# Altium project PBL4_2026L_runIT.PrjPcb (part 2 of 2)

## Sheet MCU.SchDoc: ESP32-S3
size 292 x 193 mm; CheckedBy: Jakub Howors; Author: Łukasz Gójski; CompanyName: Politechnika Warszawska; Organization: EITI; Address1: Nowowiejska 15/19; Address2: 00-665 Warszawa; Revision: 1.0; SheetNumber: 8; SheetTotal: 13; HTTPLink: www.pw.edu.pl; Group_Name: grupa 3; ProjName: runIT
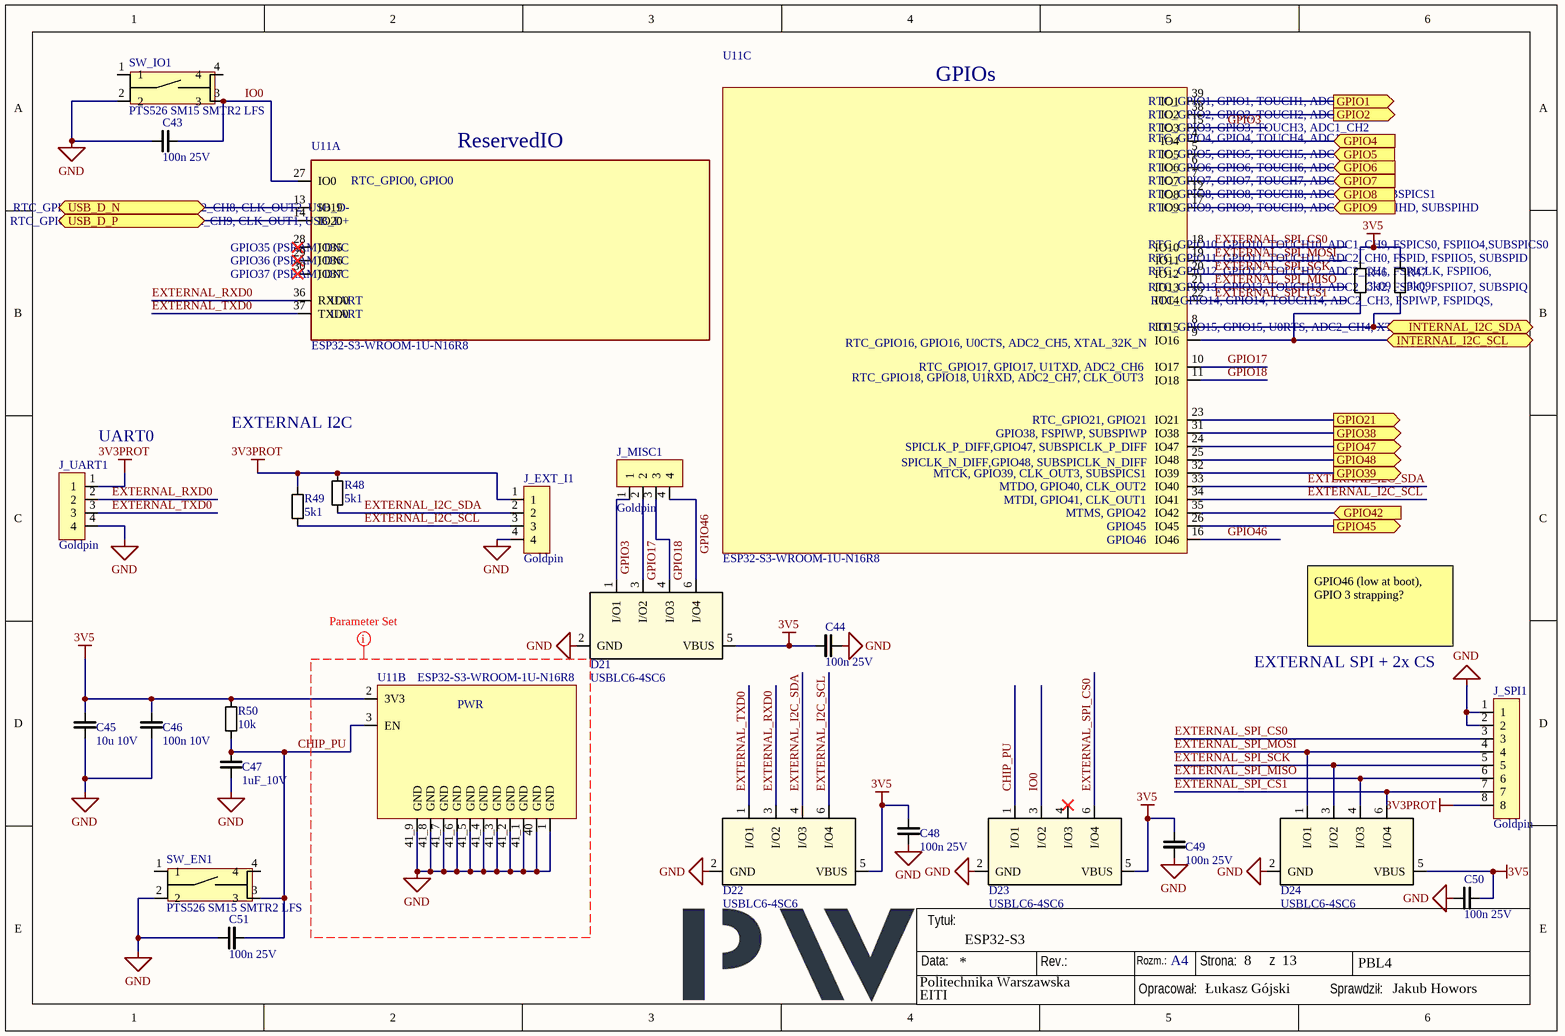
[diagram p10: MCU.SchDoc]

### Parts
C43  100n 25V  [C_0603]
C44  100n 25V  [C_0603]
C45  10u 10V  [C_0805]
C46  100n 10V  [C_0603]
C47  1uF_10V  [C_0603]
C48  100n 25V  [C_0603]
C49  100n 25V  [C_0603]
C50  100n 25V  [C_0603]
C51  100n 25V  [C_0603]
D21  USBLC6-4SC6  [SOT23-6L_STM]
D22  USBLC6-4SC6  [SOT23-6L_STM]
D23  USBLC6-4SC6  [SOT23-6L_STM]
D24  USBLC6-4SC6  [SOT23-6L_STM]
J_EXT_I1  Goldpin  [goldpin4]
J_MISC1  Goldpin  [goldpin4]
J_SPI1  Goldpin  [goldpin8]
J_UART1  Goldpin  [goldpin4]
R46  3k09  [R_0603]
R47  3k09  [R_0603]
R48  5k1  [R_0603]
R49  5k1  [R_0603]
R50  10k  [R_0603]
SW_EN1  PTS526 SM15 SMTR2 LFS  [PTS526SK15SMTR2LFS]
SW_IO1  PTS526 SM15 SMTR2 LFS  [PTS526SK15SMTR2LFS]
U11  ESP32-S3-WROOM-1U-N16R8  [XCVR_ESP32-S3-WROOM-1U-N16R8]  (parts A,B,C of 3)

### Ports
GPIO1 (out, see MainAssembly[2D]), GPIO2 (out, see MainAssembly[2D]), GPIO4 (in, see MainAssembly[1D]), GPIO5 (in, see MainAssembly[1D]), GPIO6 (in, see MainAssembly[1E]), GPIO7 (in, see MainAssembly[1E]), GPIO8 (in, see MainAssembly[1D]), GPIO9 (in, see MainAssembly[1D]), GPIO21 (out, see MainAssembly[2D]), GPIO38 (out, see MainAssembly[2E]), GPIO39 (out, see MainAssembly[2E]), GPIO42 (in, see MainAssembly[1D]), GPIO45 (out, see MainAssembly[2D]), GPIO47 (out, see MainAssembly[2D]), GPIO48 (out, see MainAssembly[2D]), INTERNAL_I2C_SCL (bidir, see MainAssembly[2C], PowerAssembly[4D]), INTERNAL_I2C_SDA (bidir, see MainAssembly[2C], PowerAssembly[4C]), USB_D_N (bidir, see MainAssembly[1C], PowerAssembly[1A], USBPD[1D]), USB_D_P (bidir, see MainAssembly[1C], PowerAssembly[1A], USBPD[1D])

### Nets
3V3PROT: J_EXT_I1.1 J_SPI1.8 J_UART1.1 R48.2 R49.2
3V5: C44.2 C45.2 C46.2 C48.2 C49.2 C50.2 D21.5(VBUS) D22.5(VBUS) D23.5(VBUS) D24.5(VBUS) R46.2 R47.2 R50.2 U11.2(3V3)
GND: C43.1 C44.1 C45.1 C46.1 C47.1 C48.1 C49.1 C50.1 C51.1 D21.2(GND) D22.2(GND) D23.2(GND) D24.2(GND) J_EXT_I1.4 J_SPI1.1 J_SPI1.2 J_UART1.4 SW_EN1.2 SW_IO1.2 U11.1(GND) U11.40(GND) U11.41_1(GND) U11.41_2(GND) U11.41_3(GND) U11.41_4(GND) U11.41_5(GND) U11.41_6(GND) U11.41_7(GND) U11.41_8(GND) U11.41_9(GND)
ADS_ALERT: U11.35(IO42) ; port GPIO42
CHIP_PU: C47.2 C51.2 D23.1(I/O1) R50.1 SW_EN1.3 U11.3(EN)
DRV_1_EN1: U11.31(IO38) ; port GPIO38
DRV_1_EN2: U11.32(IO39) ; port GPIO39
DRV_1_EN3: U11.38(IO2) ; port GPIO2
DRV_1_EN4: U11.39(IO1) ; port GPIO1
DRV_1_IN1: U11.23(IO21) ; port GPIO21
DRV_1_IN2: U11.24(IO47) ; port GPIO47
DRV_1_IN3: U11.25(IO48) ; port GPIO48
DRV_1_IN4: U11.26(IO45) ; port GPIO45
DRV_1_IPROPI_1: U11.7(IO7) ; port GPIO7
DRV_1_IPROPI_2: U11.6(IO6) ; port GPIO6
DRV_1_IPROPI_3: U11.5(IO5) ; port GPIO5
DRV_1_IPROPI_4: U11.4(IO4) ; port GPIO4
EXTERNAL_I2C_SCL: D22.6(I/O4) J_EXT_I1.3 R49.1 U11.34(IO41)
EXTERNAL_I2C_SDA: D22.4(I/O3) J_EXT_I1.2 R48.1 U11.33(IO40)
EXTERNAL_RXD0: D22.3(I/O2) J_UART1.2 U11.36(RXD0)
EXTERNAL_SPI_CS0: D23.6(I/O4) J_SPI1.3 U11.18(IO10)
EXTERNAL_SPI_CS1: D24.6(I/O4) J_SPI1.7 U11.22(IO14)
EXTERNAL_SPI_MISO: D24.4(I/O3) J_SPI1.6 U11.21(IO13)
EXTERNAL_SPI_MOSI: D24.1(I/O1) J_SPI1.4 U11.19(IO11)
EXTERNAL_SPI_SCK: D24.3(I/O2) J_SPI1.5 U11.20(IO12)
EXTERNAL_TXD0: D22.1(I/O1) J_UART1.3 U11.37(TXD0)
GPIO3: D21.1(I/O1) J_MISC1.1 U11.15(IO3)
GPIO17: D21.3(I/O2) J_MISC1.2 U11.10(IO17)
GPIO18: D21.4(I/O3) J_MISC1.3 U11.11(IO18)
GPIO46: D21.6(I/O4) J_MISC1.4 U11.16(IO46)
INTERNAL_I2C_SCL: R46.1 U11.9(IO16) ; port INTERNAL_I2C_SCL
INTERNAL_I2C_SDA: R47.1 U11.8(IO15) ; port INTERNAL_I2C_SDA
IO0: C43.2 D23.3(I/O2) SW_IO1.3 U11.27(IO0)
TCA6424_nINT: U11.17(IO9) ; port GPIO9
TCA6424_nRESET: U11.12(IO8) ; port GPIO8
USB_D_N: U11.13(IO19) ; port USB_D_N
USB_D_P: U11.14(IO20) ; port USB_D_P

Not connected (* = marked no-connect by the designer): D23 4(I/O3)*; SW_EN1 1 4; SW_IO1 1 4; U11 28(IO35)* 29(IO36)* 30(IO37)*

### Layout directives
CompClassName: NoRelief: GND

### Notes on the sheet
- (near J_UART1) UART0
- EXTERNAL I2C
- GPIO46 (low at boot), GPIO 3 strapping?
- EXTERNAL SPI + 2x CS
- Data:
- Tytuł:
- Rev.:
- Rozm.:
- A4
- Strona:
- z
- PBL4
- Opracował:
- Sprawdził:
- (in symbol ESP32-S3-WROOM-1U-N16R8, part A) ReservedIO; RTC_GPIO0, GPIO0; RTC_GPIO19, GPIO19, U1RTS, ADC2_CH8, CLK_OUT2, USB_D-; RTC_GPIO20, GPIO20, U1CTS, ADC2_CH9, CLK_OUT1, USB_D+; GPIO35 (PSRAM) DNC; GPIO36 (PSRAM) DNC; GPIO37 (PSRAM) DNC; UART
- (in symbol ESP32-S3-WROOM-1U-N16R8, part B) PWR
- (in symbol ESP32-S3-WROOM-1U-N16R8, part C) GPIOs; RTC_GPIO1, GPIO1, TOUCH1, ADC1_CH0; RTC_GPIO2, GPIO2, TOUCH2, ADC1_CH1; RTC_GPIO3, GPIO3, TOUCH3, ADC1_CH2; RTC_GPIO4, GPIO4, TOUCH4, ADC1_CH3; RTC_GPIO5, GPIO5, TOUCH5, ADC1_CH4; RTC_GPIO6, GPIO6, TOUCH6, ADC1_CH5; RTC_GPIO7, GPIO7, TOUCH7, ADC1_CH6; RTC_GPIO8, GPIO8, TOUCH8, ADC1_CH7, SUBSPICS1; RTC_GPIO9, GPIO9, TOUCH9, ADC1_CH8, FSPIHD, SUBSPIHD; RTC_GPIO10, GPIO10, TOUCH10, ADC1_CH9, FSPICS0, FSPIIO4,SUBSPICS0; RTC_GPIO11, GPIO11, TOUCH11, ADC2_CH0, FSPID, FSPIIO5, SUBSPID; RTC_GPIO12, GPIO12, TOUCH12, ADC2_CH1, FSPICLK, FSPIIO6,; RTC_GPIO13, GPIO13, TOUCH13, ADC2_CH2, FSPIQ, FSPIIO7, SUBSPIQ; RTC_GPIO14, GPIO14, TOUCH14, ADC2_CH3, FSPIWP, FSPIDQS,; RTC_GPIO15, GPIO15, U0RTS, ADC2_CH4, XTAL_32K_P; RTC_GPIO16, GPIO16, U0CTS, ADC2_CH5, XTAL_32K_N; RTC_GPIO17, GPIO17, U1TXD, ADC2_CH6; RTC_GPIO18, GPIO18, U1RXD, ADC2_CH7, CLK_OUT3; RTC_GPIO21, GPIO21; GPIO38, FSPIWP, SUBSPIWP; SPICLK_P_DIFF,GPIO47, SUBSPICLK_P_DIFF; SPICLK_N_DIFF,GPIO48, SUBSPICLK_N_DIFF; MTCK, GPIO39, CLK_OUT3, SUBSPICS1; MTDO, GPIO40, CLK_OUT2; MTDI, GPIO41, CLK_OUT1; MTMS, GPIO42; GPIO45; GPIO46

### Library data of the parts
C43 C44 C48-C51 = C_100nF_25V: Ceramic capacitor; Casing: 0603; Dielectric: X7R; Tolerance: 10%; Value: 100n; Voltage: 25V; Technology: Ceramic
C45 = C_10uF_10V: Ceramic capacitor; Casing: 0805; Dielectric: X5R; Tolerance: 10%; Value: 10u; Voltage: 10V; Technology: Ceramic
C46 = C_100nF_10V: as C19 on sheet DCDC3; Value: 100n; Voltage: 10V; Technology: Ceramic
C47 = C_1uF_10V: as C31 on sheet PowerAssembly; Technology: Ceramic
D21-D24 = USBLC6-4SC6: Very low capacitance ESD protection; Manufacturer: STMicroelectronics; Manufacturer_Part_Number: USBLC6-4SC6
J_EXT_I1 J_MISC1 J_UART1 = Goldpin_array_4: Goldpin Male 4
J_SPI1 = Goldpin_array_8: Goldpin Male 8
R46 R47 = R_3k09: Resistor; Tolerance: 1%; Power: 100mW; Casing: 0603; Value: 3k09
R48 R49 = R_5k1: Resistor; Tolerance: 1%; Power: 100mW; Casing: 0603; Value: 5k1
R50 = R_10k: as R75 on sheet PowerAssembly; Value: 10k
SW_EN1 SW_IO1 = Button: NO button; Manufacturer: C&K Components; Manufacturer_Part_Number: PTS526 SM15 SMTR2 LFS
U11 = ESP32-S3-WROOM-1U-N16R8: Bluetooth, WiFi 802.11b/g/n, Bluetooth v5.0 Transceiver Module 2.4GHz Antenna Not Included, U.FL Surface Mount; MF: Espressif Systems; Package: None; Price: None; Value: *; SnapEDA_Link: https://www.snapeda.com/parts/ESP32-S3-WROOM-1U-N16R8/Espressif+Systems/view-part/?ref=snap; MP: ESP32-S3-WROOM-1U-N16R8; Availability: Unavailable; Check_prices: https://www.snapeda.com/parts/ESP32-S3-WROOM-1U-N16R8/Espressif+Systems/view-part/?ref=eda

## Sheet ADCHighVoltageInputsSchDoc.SchDoc: High Voltage Inputs
size 292 x 193 mm; CheckedBy: Łukasz Gójski; Author: Jakub Howors; CompanyName: Politechnika Warszawska; Organization: EITI; Address1: Nowowiejska 15/19; Address2: 00-665 Warszawa; Revision: 1.0; SheetNumber: 9; SheetTotal: 13; HTTPLink: www.pw.edu.pl; Group_Name: grupa 3; ProjName: runIT
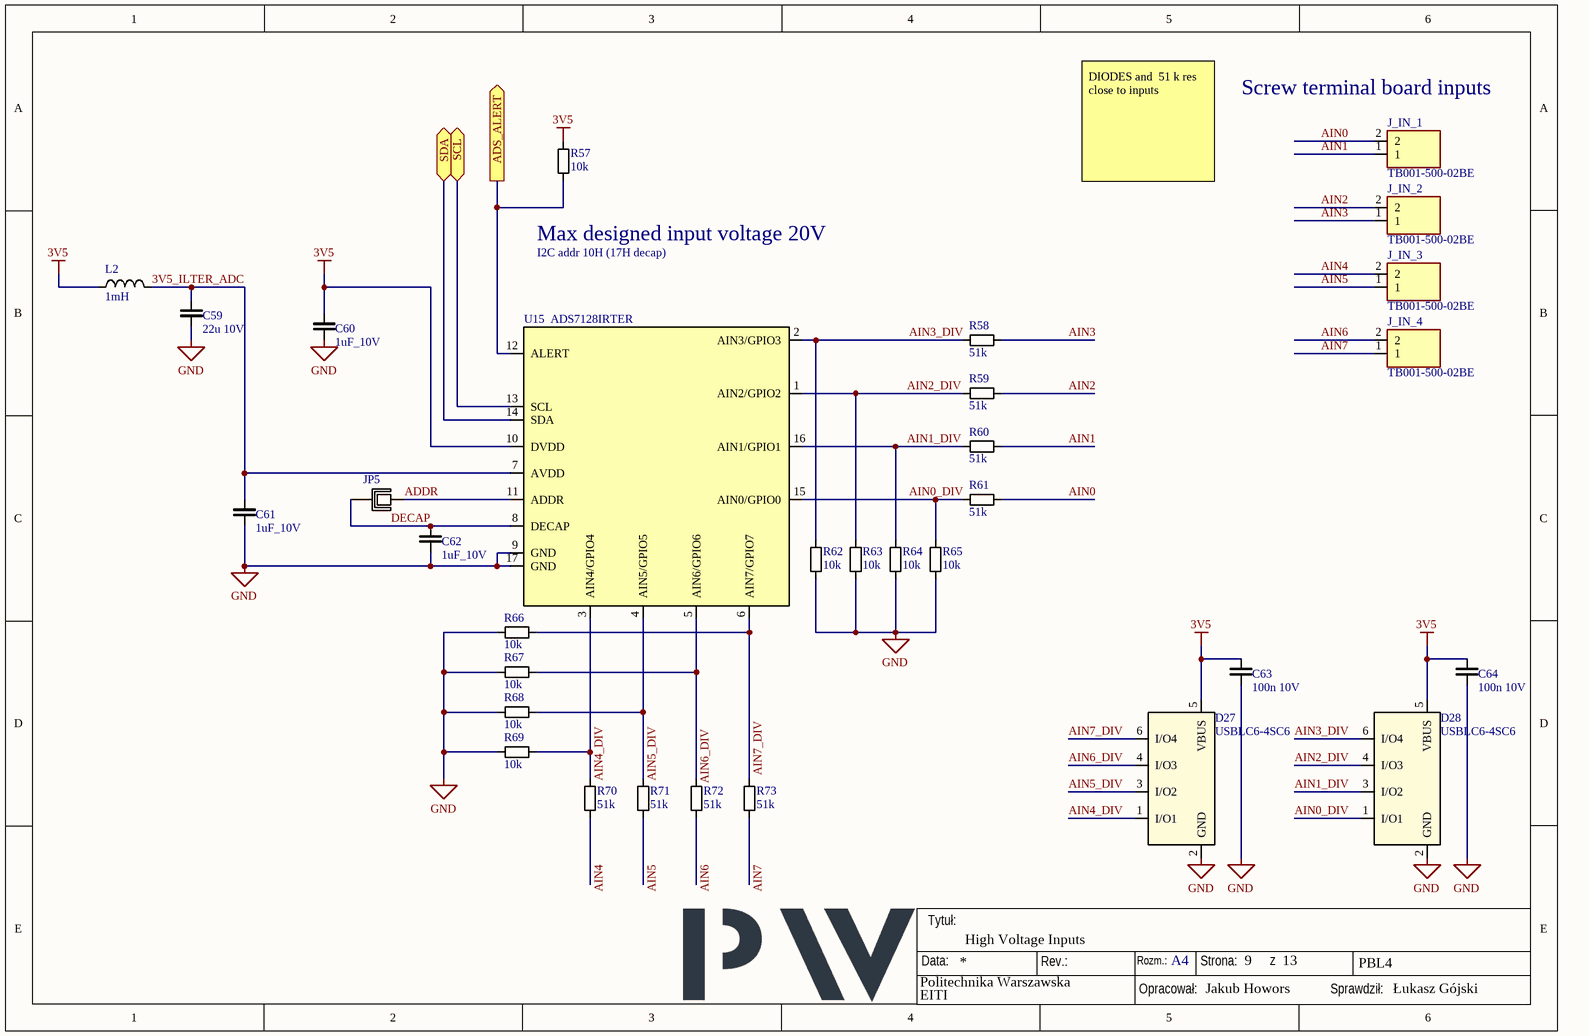
[diagram p11: ADCHighVoltageInputsSchDoc.SchDoc]

### Parts
C59  22u 10V  [C_1206]
C60  1uF_10V  [C_0603]
C61  1uF_10V  [C_0603]
C62  1uF_10V  [C_0603]
C63  100n 10V  [C_0603]
C64  100n 10V  [C_0603]
D27  USBLC6-4SC6  [SOT23-6L_STM]
D28  USBLC6-4SC6  [SOT23-6L_STM]
J_IN_1  TB001-500-02BE  [TB00150002BE]
J_IN_2  TB001-500-02BE  [TB00150002BE]
J_IN_3  TB001-500-02BE  [TB00150002BE]
J_IN_4  TB001-500-02BE  [TB00150002BE]
JP5  JUMPER  [Jumper]  (value not drawn)
L2  1mH  [L_1007]
R57  10k  [R_0603]
R58  51k  [R_0603]
R59  51k  [R_0603]
R60  51k  [R_0603]
R61  51k  [R_0603]
R62  10k  [R_0603]
R63  10k  [R_0603]
R64  10k  [R_0603]
R65  10k  [R_0603]
R66  10k  [R_0603]
R67  10k  [R_0603]
R68  10k  [R_0603]
R69  10k  [R_0603]
R70  51k  [R_0603]
R71  51k  [R_0603]
R72  51k  [R_0603]
R73  51k  [R_0603]
U15  ADS7128IRTER  [ADS7128_RTE0016C]

### Ports
ADS_ALERT (out, see MainAssembly[2B]), SCL (bidir, see MainAssembly[1B], DAC[3C], DCDCreg[2C], GPIOExpander[2B], PWMExpander[2B], USBPD[4C]), SDA (bidir, see MainAssembly[1B], DAC[3C], DCDCreg[2C], GPIOExpander[2B], PWMExpander[2A], USBPD[4C])

### Nets
3V5: C60.2 C63.2 C64.2 D27.5(VBUS) D28.5(VBUS) L2.1 R57.2 U15.10(DVDD)
GND: C59.1 C60.1 C61.1 C62.1 C63.1 C64.1 D27.2(GND) D28.2(GND) R62.2 R63.2 R64.2 R65.2 R66.2 R67.2 R68.2 R69.2 U15.9(GND) U15.17(GND)
3V5_ILTER_ADC: C59.2 C61.2 L2.2 U15.7(AVDD)
ADDR: JP5.1 U15.11(ADDR)
ADS_ALERT: R57.1 U15.12(ALERT) ; port ADS_ALERT
AIN0: J_IN_1.2 R61.2
AIN0_DIV: D28.1(I/O1) R61.1 R65.1 U15.15(AIN0/GPIO0)
AIN1: J_IN_1.1 R60.2
AIN1_DIV: D28.3(I/O2) R60.1 R64.1 U15.16(AIN1/GPIO1)
AIN2: J_IN_2.2 R59.2
AIN2_DIV: D28.4(I/O3) R59.1 R63.1 U15.1(AIN2/GPIO2)
AIN3: J_IN_2.1 R58.2
AIN3_DIV: D28.6(I/O4) R58.1 R62.1 U15.2(AIN3/GPIO3)
AIN4: J_IN_3.2 R70.2
AIN4_DIV: D27.1(I/O1) R69.1 R70.1 U15.3(AIN4/GPIO4)
AIN5: J_IN_3.1 R71.2
AIN5_DIV: D27.3(I/O2) R68.1 R71.1 U15.4(AIN5/GPIO5)
AIN6: J_IN_4.2 R72.2
AIN6_DIV: D27.4(I/O3) R67.1 R72.1 U15.5(AIN6/GPIO6)
AIN7: J_IN_4.1 R73.2
AIN7_DIV: D27.6(I/O4) R66.1 R73.1 U15.6(AIN7/GPIO7)
DECAP: C62.2 JP5.2 U15.8(DECAP)
INTERNAL_I2C_SCL: U15.13(SCL) ; port SCL
INTERNAL_I2C_SDA: U15.14(SDA) ; port SDA

### Notes on the sheet
- (near J_IN_1) Screw terminal board inputs
- DIODES and  51 k res close to inputs
- (near R57) Max designed input voltage 20V
- I2C addr 10H (17H decap)
- Data:
- Tytuł:
- Rev.:
- Rozm.:
- A4
- Strona:
- z
- PBL4
- Opracował:
- Sprawdził:

### Library data of the parts
C59 = C_22uF_10V: Ceramic capacitor; Casing: 1206; Dielectric: X5R; Tolerance: 20%; Value: 22u; Voltage: 10V; Technology: Ceramic
C60-C62 = C_1uF_10V: Ceramic capacitor; Value: 1u; Voltage: 10V; Casing: 0603; Dielectric: X7R; Tolerance: 10%; Technology: Ceramic
C63 C64 = C_100nF_10V: Ceramic capacitor; Casing: 0603; Dielectric: X7R; Tolerance: 10%; Value: 100n; Voltage: 10V; Technology: Ceramic
D27 D28 = USBLC6-4SC6: Very low capacitance ESD protection; Manufacturer: STMicroelectronics; Manufacturer_Part_Number: USBLC6-4SC6
J_IN_1-J_IN_4 = Screw Terminal x2 5mm: Screw terminal x2 5mm spacing; Manufacturer: Same Sky; MP: TB001-500-02BE
JP5 = Jumper x2: Jumper on traces
L2 = L_1mH: Inductor; Casing: 1007; Tolerance: 20%; Idc: 15mA; Value: 1mH
R57 = R_10k: Resistor; Tolerance: 1%; Power: 100mW; Casing: 0603; Value: 10k
R58-R61 R70-R73 = R_51k_LT: Tolerance: 0.1%; Power: 100mW; Casing: 0603; Value: 51k
R62-R69 = R_10k_LT: Tolerance: 0.1%; Power: 125mW; Casing: 0603; Value: 10k
U15 = IC_ads7128_ADS7128IRTER: Small 8-ch 12-bit analog-to-digital converter (ADC) with I2C interface, GPIOs, CRC and RMS module 16-WQFN -40 to 85; Manufacturer_Name: Texas Instruments; Type: Data Acquisition; Copyright: Copyright (C) 2026 Ultra Librarian. All rights reserved.; Manufacturer_Part_Number: ADS7128IRTER; Datasheet: https://www.ti.com/lit/gpn/ads7128; RefDes: RefDes

## Sheet GPIOExpander.SchDoc: Internal GPIO Expander
size 292 x 193 mm; CheckedBy: Łukasz Gójski; Author: Jakub Howors; CompanyName: Politechnika Warszawska; Organization: EITI; Address1: Nowowiejska 15/19; Address2: 00-665 Warszawa; Revision: 1.0; SheetNumber: 7; SheetTotal: 13; HTTPLink: www.pw.edu.pl; Group_Name: grupa 3; ProjName: runIT
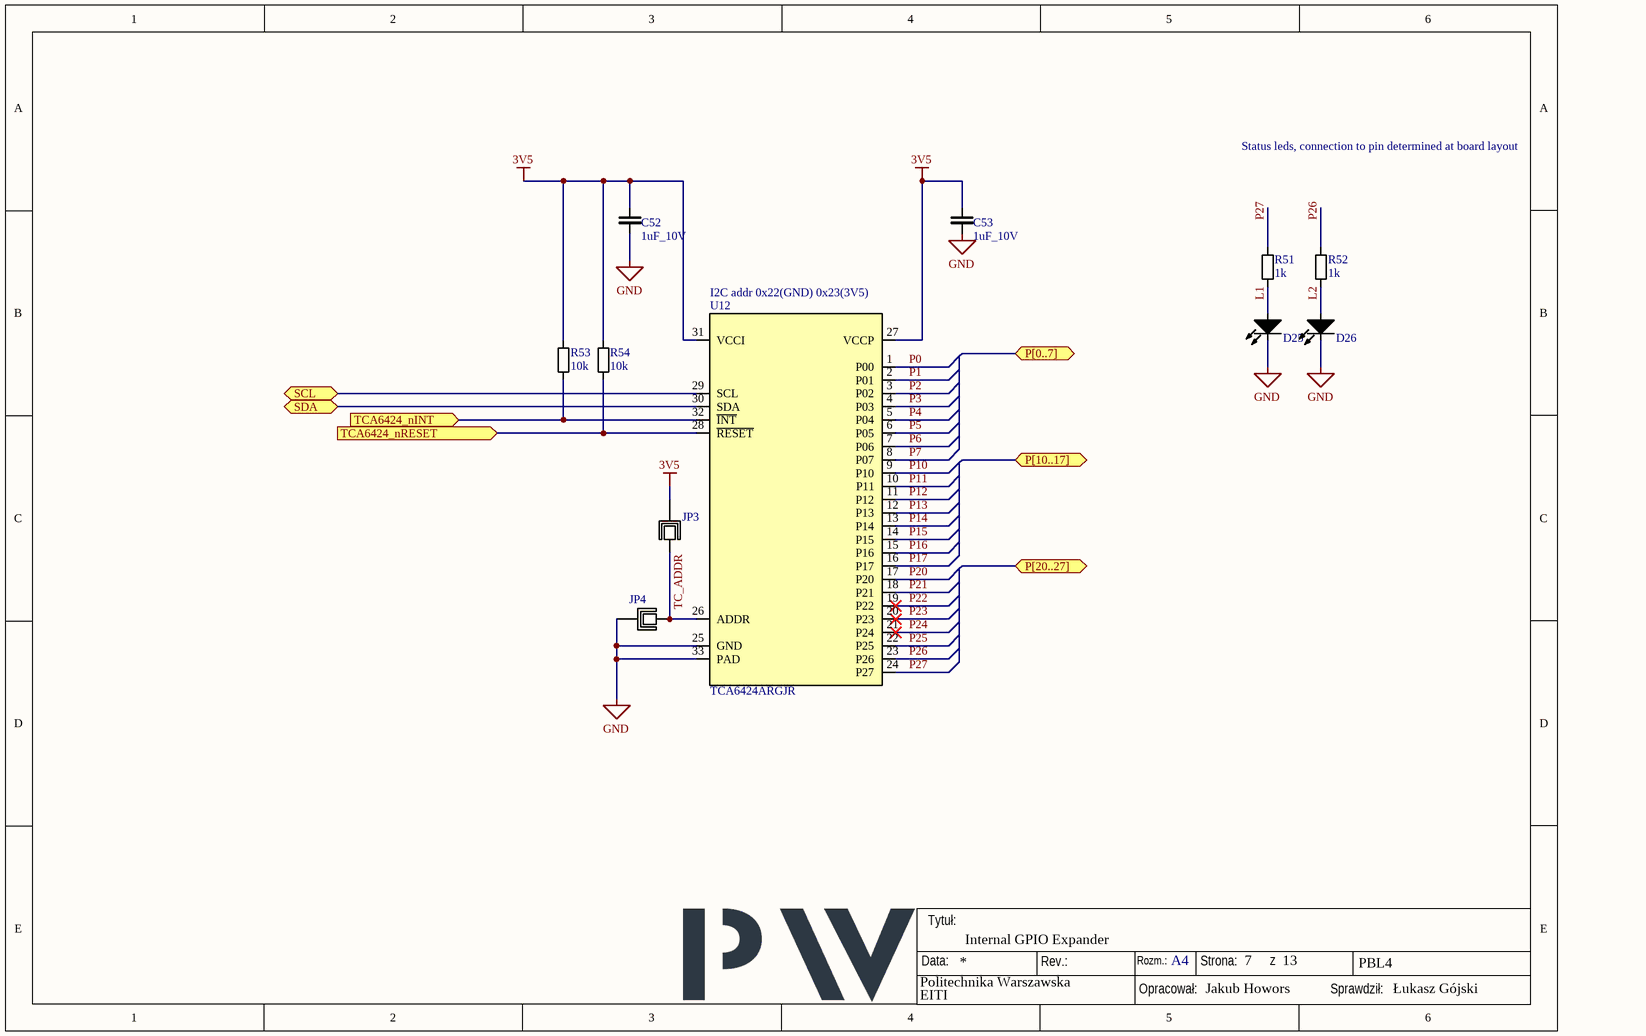
[diagram p12: GPIOExpander.SchDoc]

### Parts
C52  1uF_10V  [C_0603]
C53  1uF_10V  [C_0603]
D25  RED  [LED_0603]  (value not drawn)
D26  RED  [LED_0603]  (value not drawn)
JP3  JUMPER  [Jumper]  (value not drawn)
JP4  JUMPER  [Jumper]  (value not drawn)
R51  1k  [R_0603]
R52  1k  [R_0603]
R53  10k  [R_0603]
R54  10k  [R_0603]
U12  TCA6424ARGJR  [TCA6424A_RGJ0032A]

### Ports
P[0..7] (bidir, see MainAssembly[5D]), P[10..17] (bidir, see MainAssembly[5D]), P[20..27] (bidir, see MainAssembly[6D]), SCL (bidir, see MainAssembly[5D], ADCHighVoltageInputsSchDoc[2A], DAC[3C], DCDCreg[2C], PWMExpander[2B], USBPD[4C]), SDA (bidir, see MainAssembly[5D], ADCHighVoltageInputsSchDoc[2A], DAC[3C], DCDCreg[2C], PWMExpander[2A], USBPD[4C]), TCA6424_nINT (in, see MainAssembly[5D]), TCA6424_nRESET (in, see MainAssembly[5D])

### Nets
3V5: C52.2 C53.2 JP3.2 R53.2 R54.2 U12.27(VCCP) U12.31(VCCI)
GND: C52.1 C53.1 D25.K D26.K JP4.2 U12.25(GND) U12.33(PAD)
INTERNAL_I2C_SCL: U12.29(SCL) ; port SCL
INTERNAL_I2C_SDA: U12.30(SDA) ; port SDA
L1: D25.A R51.1
L2: D26.A R52.1
P0: U12.1(P00)
P1: U12.2(P01)
P2: U12.3(P02)
P3: U12.4(P03)
P4: U12.5(P04)
P5: U12.6(P05)
P6: U12.7(P06)
P7: U12.8(P07)
P10: U12.9(P10)
P11: U12.10(P11)
P12: U12.11(P12)
P13: U12.12(P13)
P14: U12.13(P14)
P15: U12.14(P15)
P16: U12.15(P16)
P17: U12.16(P17)
P20: U12.17(P20)
P21: U12.18(P21)
P22: U12.19(P22)
P23: U12.20(P23)
P24: U12.21(P24)
P25: U12.22(P25)
P26: R52.2 U12.23(P26)
P27: R51.2 U12.24(P27)
TC_ADDR: JP3.1 JP4.1 U12.26(ADDR)
TCA6424_nINT: R53.1 U12.32(~{INT}) ; port TCA6424_nINT
TCA6424_nRESET: R54.1 U12.28(~{RESET}) ; port TCA6424_nRESET

### Notes on the sheet
- Status leds, connection to pin determined at board layout
- (near U12) I2C addr 0x22(GND) 0x23(3V5)
- Data:
- Tytuł:
- Rev.:
- Rozm.:
- A4
- Strona:
- z
- PBL4
- Opracował:
- Sprawdził:

### Library data of the parts
C52 C53 = C_1uF_10V: as C60-C62 on sheet ADCHighVoltageInputsSchDoc; Technology: Ceramic
D25 D26 = LED_0603: LED RED 0603 3.3V; Casing: 0603; Color: RED
JP3 JP4 = Jumper x2: Jumper on traces
R51 R52 = R_1k: Resistor; Tolerance: 1%; Power: 100mW; Casing: 0603; Value: 1k
R53 R54 = R_10k: as R57 on sheet ADCHighVoltageInputsSchDoc; Value: 10k
U12 = IC_tca6424a_TCA6424ARGJR: 24-bit translating 1.65- to 5.5-V I2C/SMBus I/O expander with interrupt, reset & config registers 32-UQFN -40 to 85; Manufacturer: Texas Instruments; Manufacturer_Part_Number: TCA6424ARGJR; PartNumber: TCA6424ARGJR; PackageReference: RGJ0032A

## Nets that join several sheets
3V3PROT: PowerAssembly (C30.2 D5.K J_1.1), MCU (5 pins)
3V5: PowerAssembly (10 pins), DCDC3 (R12.2), U_PowerAssembly/Reg (R7A.2), U_PowerAssembly/Reg5 (R7B.2 U4B.2), U_PowerOutputsAssembly/DRV1 (C35A.2 JP1A.1 R28A.1 U9A.25), U_PowerOutputsAssembly/DRV2 (C35B.2 JP1B.1 R28B.1 U9B.25), DAC (L3.1), PWMExpander (8 pins), MCU (14 pins), ADCHighVoltageInputsSchDoc (8 pins), GPIOExpander (7 pins)
GND: PowerAssembly (28 pins), DCDC3 (10 pins), U_PowerAssembly/Reg (17 pins), USBPD (24 pins), U_PowerAssembly/Reg5 (16 pins), U_PowerOutputsAssembly/U_MuxVM_1 (9 pins), U_PowerOutputsAssembly/U_MuxVM_2 (9 pins), U_PowerOutputsAssembly/DRV1 (17 pins), U_PowerOutputsAssembly/DRV2 (17 pins), DAC (8 pins), PWMExpander (30 pins), MCU (30 pins), ADCHighVoltageInputsSchDoc (18 pins), GPIOExpander (7 pins)
VREG: PowerAssembly (D10.K J_VREG2.1 U8.12), U_PowerAssembly/Reg (R9A.1 R_S1A.2), PowerOutputsAssembly (JP6.1)
VREG5: PowerAssembly (D8.K J_VREG1.1 U8.2), U_PowerAssembly/Reg5 (R9B.1 R_S1B.2), PowerOutputsAssembly (JP7.1), PWMExpander (10 pins)
VSUP: PowerAssembly (6 pins), DCDC3 (C21.2 C22.2 U5.8), U_PowerOutputsAssembly/U_MuxVM_1 (C54A.2 U13A.5), U_PowerOutputsAssembly/U_MuxVM_2 (C57B.2 U14B.5)
3V5_OUT: PowerAssembly (OUT_1.1), DCDC3 (5 pins)
ADS_ALERT: MCU (U11.35), ADCHighVoltageInputsSchDoc (R57.1 U15.12)
DRV_1_EN1: U_PowerOutputsAssembly/DRV1 (U9A.37), MCU (U11.31)
DRV_1_EN2: U_PowerOutputsAssembly/DRV1 (U9A.36), MCU (U11.32)
DRV_1_EN3: U_PowerOutputsAssembly/DRV1 (U9A.35), MCU (U11.38)
DRV_1_EN4: U_PowerOutputsAssembly/DRV1 (U9A.34), MCU (U11.39)
DRV_1_IN1: U_PowerOutputsAssembly/DRV1 (U9A.41), MCU (U11.23)
DRV_1_IN2: U_PowerOutputsAssembly/DRV1 (U9A.40), MCU (U11.24)
DRV_1_IN3: U_PowerOutputsAssembly/DRV1 (U9A.39), MCU (U11.25)
DRV_1_IN4: U_PowerOutputsAssembly/DRV1 (U9A.38), MCU (U11.26)
DRV_1_IPROPI_1: U_PowerOutputsAssembly/DRV1 (R27A.2 U9A.32), MCU (U11.7)
DRV_1_IPROPI_2: U_PowerOutputsAssembly/DRV1 (R26A.2 U9A.31), MCU (U11.6)
DRV_1_IPROPI_3: U_PowerOutputsAssembly/DRV1 (R25A.2 U9A.30), MCU (U11.5)
DRV_1_IPROPI_4: U_PowerOutputsAssembly/DRV1 (R24A.2 U9A.29), MCU (U11.4)
DRV_2_EN1: U_PowerOutputsAssembly/DRV2 (U9B.37), PWMExpander (U10.16)
DRV_2_EN2: U_PowerOutputsAssembly/DRV2 (U9B.36), PWMExpander (U10.17)
DRV_2_EN3: U_PowerOutputsAssembly/DRV2 (U9B.35), PWMExpander (U10.18)
DRV_2_EN4: U_PowerOutputsAssembly/DRV2 (U9B.34), PWMExpander (U10.19)
DRV_2_IN1: U_PowerOutputsAssembly/DRV2 (U9B.41), PWMExpander (U10.12)
DRV_2_IN2: U_PowerOutputsAssembly/DRV2 (U9B.40), PWMExpander (U10.13)
DRV_2_IN3: U_PowerOutputsAssembly/DRV2 (U9B.39), PWMExpander (U10.14)
DRV_2_IN4: U_PowerOutputsAssembly/DRV2 (U9B.38), PWMExpander (U10.15)
DRVs_OCPM: U_PowerOutputsAssembly/DRV1 (U9A.27), U_PowerOutputsAssembly/DRV2 (U9B.27)
DVR_1_VM: U_PowerOutputsAssembly/U_MuxVM_1 (C56A.1 U13A.6 U14A.6), U_PowerOutputsAssembly/DRV1 (8 pins)
DVR_2_VM: U_PowerOutputsAssembly/U_MuxVM_2 (C56B.1 U13B.6 U14B.6), U_PowerOutputsAssembly/DRV2 (8 pins)
INTERNAL_I2C_SCL: PowerAssembly (U8.6), U_PowerAssembly/Reg (U4A.3), USBPD (U1.5), U_PowerAssembly/Reg5 (U4B.3), DAC (U16.6), PWMExpander (U10.23), MCU (R46.1 U11.9), ADCHighVoltageInputsSchDoc (U15.13), GPIOExpander (U12.29)
INTERNAL_I2C_SDA: PowerAssembly (U8.7), U_PowerAssembly/Reg (U4A.4), USBPD (U1.4), U_PowerAssembly/Reg5 (U4B.4), DAC (U16.8), PWMExpander (U10.24), MCU (R47.1 U11.8), ADCHighVoltageInputsSchDoc (U15.14), GPIOExpander (U12.30)
MuxInA: PowerOutputsAssembly (JP7.2), U_PowerOutputsAssembly/U_MuxVM_2 (C54B.2 U13B.5)
MuxInB: PowerOutputsAssembly (JP6.2), U_PowerOutputsAssembly/U_MuxVM_1 (C57A.2 U14A.5)
P10: PowerOutputsAssembly (TP5.1), U_PowerOutputsAssembly/DRV2 (U9B.42)
P11: PowerOutputsAssembly (TP4.1), U_PowerOutputsAssembly/DRV1 (U9A.42)
REG5_R_SENS+: PowerAssembly (U8.1), U_PowerAssembly/Reg5 (9 pins)
REG_R_SENS+: PowerAssembly (U8.11), U_PowerAssembly/Reg (9 pins)
TCA6424_nINT: MCU (U11.17), GPIOExpander (R53.1 U12.32)
TCA6424_nRESET: MCU (U11.12), GPIOExpander (R54.1 U12.28)
USB_D_N: USBPD (J1.A7 J1.B7 U3.2), MCU (U11.13)
USB_D_P: USBPD (J1.A6 J1.B6 U3.1), MCU (U11.14)
VREF1: PowerOutputsAssembly (TP2.1), U_PowerOutputsAssembly/DRV1 (U9A.33), DAC (U16.1 U16.2)
VREF2: PowerOutputsAssembly (TP3.1), U_PowerOutputsAssembly/DRV2 (U9B.33), DAC (U16.11 U16.12)
VSUP: PowerAssembly (EN_VREG1.2), U_PowerAssembly/Reg (C8A.1 C9A.2 C10A.2 U4A.7)
VSUP: PowerAssembly (EN_VREG2.2), U_PowerAssembly/Reg5 (C8B.1 C9B.2 C10B.2 U4B.7)
VUSB: PowerAssembly (R14.2 U6.5), USBPD (OUT_PD1.2)